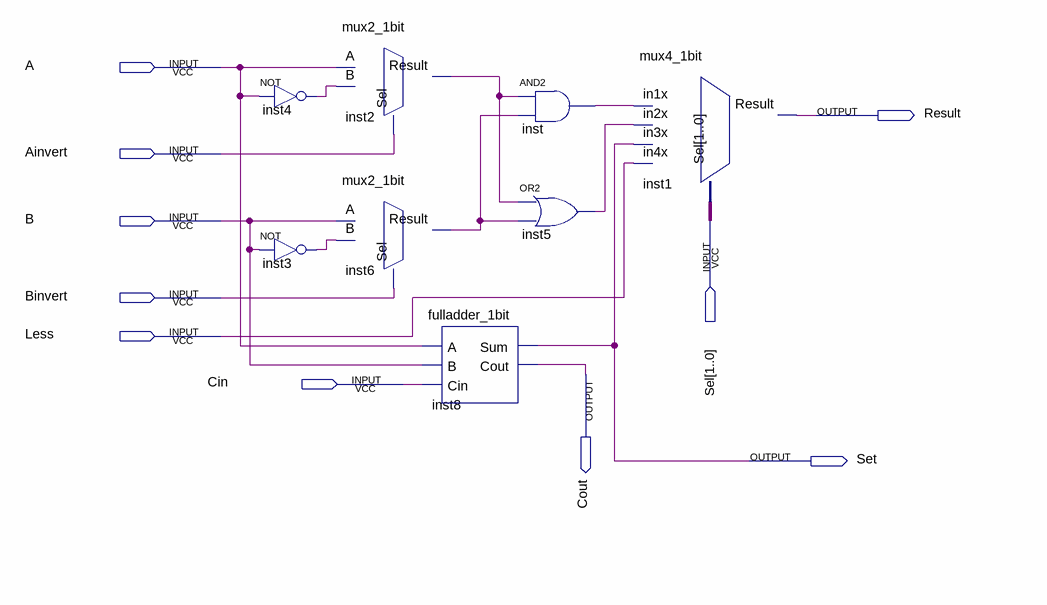
[diagram p0: schematic sheet]
// Quartus schematic alu_1bit.bdf as structural Verilog: 8 symbols, 10 pins
module alu_1bit (
  input  A,
  input  Ainvert,
  input  B,
  input  [1:0] Sel,
  input  Binvert,
  input  Less,
  input  Cin,
  output Result,
  output Cout,
  output Set
);

  wire inst2_result, inst3_out, inst4_out, inst5_out, inst6_result, inst_out;

  not inst4 (inst4_out, A);
  not inst3 (inst3_out, B);
  mux2_1bit inst2 (.Sel(Ainvert), .A(A), .B(inst4_out), .Result(inst2_result));
  mux2_1bit inst6 (.Sel(Binvert), .A(B), .B(inst3_out), .Result(inst6_result));
  fulladder_1bit inst8 (.A(A), .B(B), .Cin(Cin), .Sum(Set), .Cout(Cout));
  and inst (inst_out, inst2_result, inst6_result);
  or inst5 (inst5_out, inst2_result, inst6_result);
  mux4_1bit inst1 (.Sel(Sel), .in1x(inst_out), .in2x(inst5_out), .in3x(Set), .in4x(Less), .Result(Result));
endmodule
